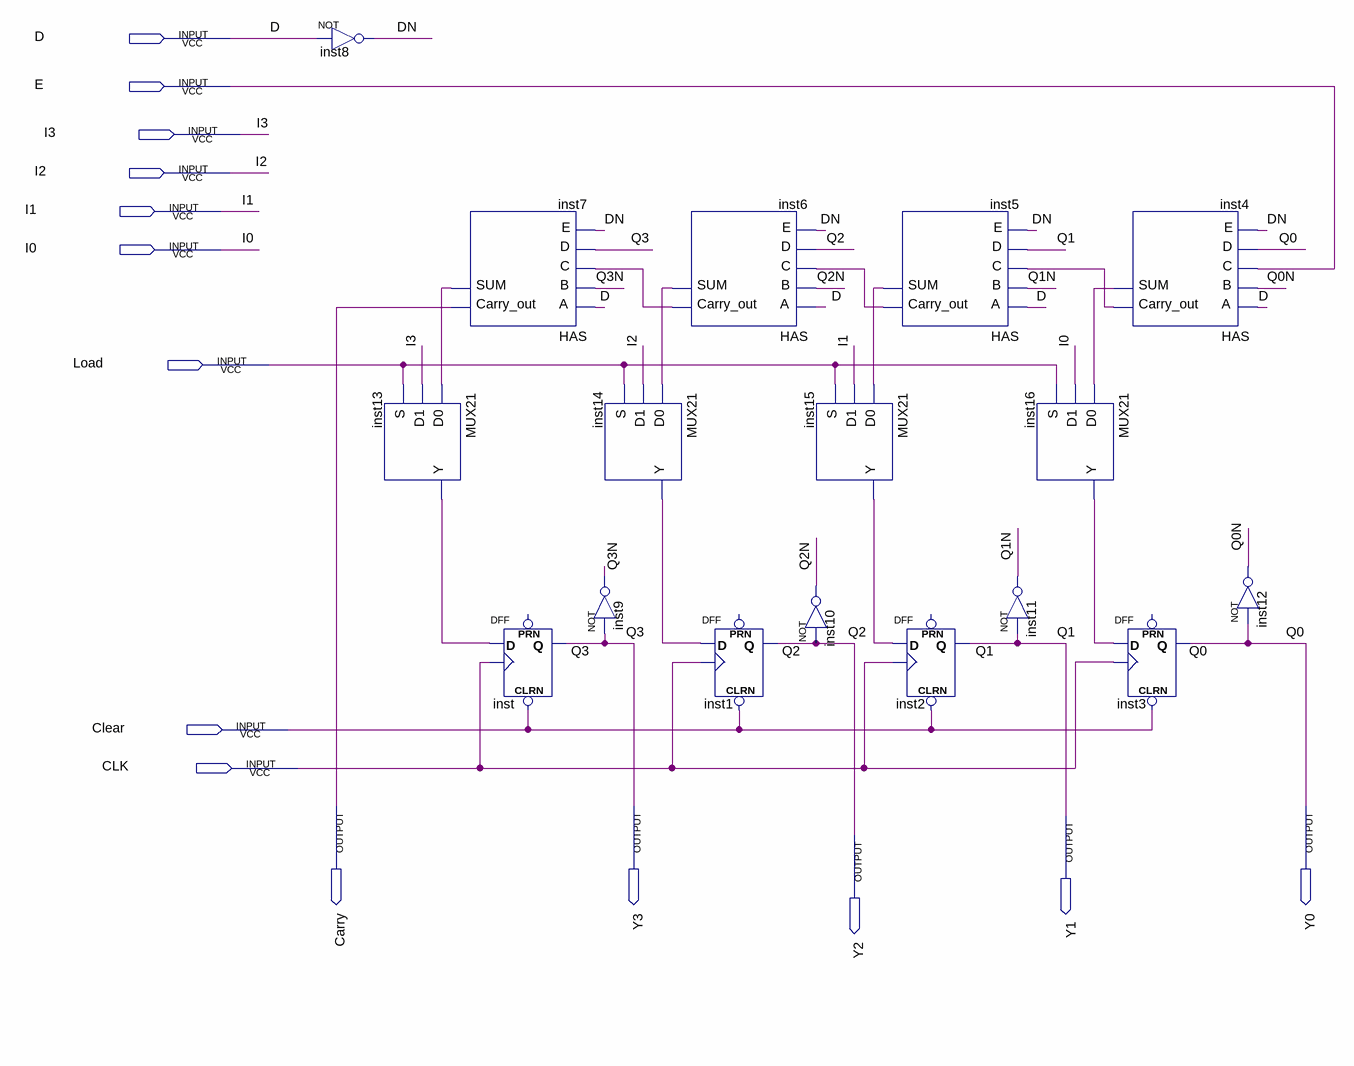
[diagram p0: schematic sheet]
// Quartus schematic Counter_4.bdf as structural Verilog: 17 symbols, 14 pins
module Counter_4 (
  input  D,
  input  E,
  input  I3,
  input  I2,
  input  I1,
  input  I0,
  input  Load,
  input  Clear,
  input  CLK,
  output Carry,
  output Y3,
  output Y0,
  output Y1,
  output Y2
);

  wire DN, inst4_carry_out, inst4_sum, inst5_carry_out, inst5_sum, inst6_carry_out, inst6_sum, inst7_sum,
       inst13_y, inst14_y, inst15_y, inst16_y, Q0N, Q1N, Q2N, Q3N;

  not inst8 (DN, D);
  MUX21 inst13 (.D0(inst7_sum), .D1(I3), .S(Load), .Y(inst13_y));
  HAS inst7 (.A(D), .B(Q3N), .C(inst6_carry_out), .D(Y3), .E(DN), .Carry_out(Carry), .SUM(inst7_sum));
  DFF inst (.CLRN(Clear), .CLK(CLK), .D(inst13_y), .Q(Y3));  // open: PRN
  MUX21 inst14 (.D0(inst6_sum), .D1(I2), .S(Load), .Y(inst14_y));
  not inst9 (Q3N, Y3);
  HAS inst6 (.A(D), .B(Q2N), .C(inst5_carry_out), .D(Y2), .E(DN), .Carry_out(inst6_carry_out), .SUM(inst6_sum));
  DFF inst1 (.CLRN(Clear), .CLK(CLK), .D(inst14_y), .Q(Y2));  // open: PRN
  MUX21 inst15 (.D0(inst5_sum), .D1(I1), .S(Load), .Y(inst15_y));
  not inst10 (Q2N, Y2);
  HAS inst5 (.A(D), .B(Q1N), .C(inst4_carry_out), .D(Y1), .E(DN), .Carry_out(inst5_carry_out), .SUM(inst5_sum));
  DFF inst2 (.CLRN(Clear), .CLK(CLK), .D(inst15_y), .Q(Y1));  // open: PRN
  MUX21 inst16 (.D0(inst4_sum), .D1(I0), .S(Load), .Y(inst16_y));
  not inst11 (Q1N, Y1);
  HAS inst4 (.A(D), .B(Q0N), .C(E), .D(Y0), .E(DN), .Carry_out(inst4_carry_out), .SUM(inst4_sum));
  DFF inst3 (.CLRN(Clear), .CLK(CLK), .D(inst16_y), .Q(Y0));  // open: PRN
  not inst12 (Q0N, Y0);

  // Other names for the same wires on the sheet: Q0 = Y0; Q1 = Y1; Q2 = Y2; Q3 = Y3
endmodule
